# Altium schematic sheet CC1101_DoorState.SchDoc
size A0
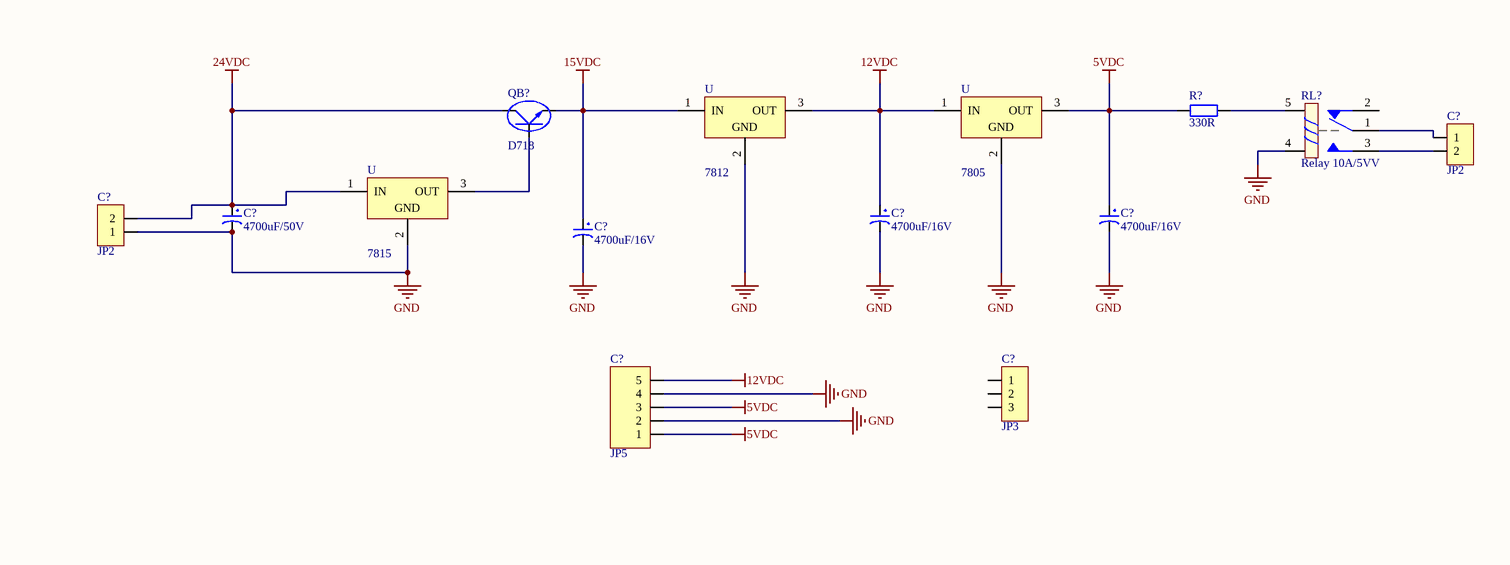
[diagram p0: CC1101_DoorState.SchDoc, top right]
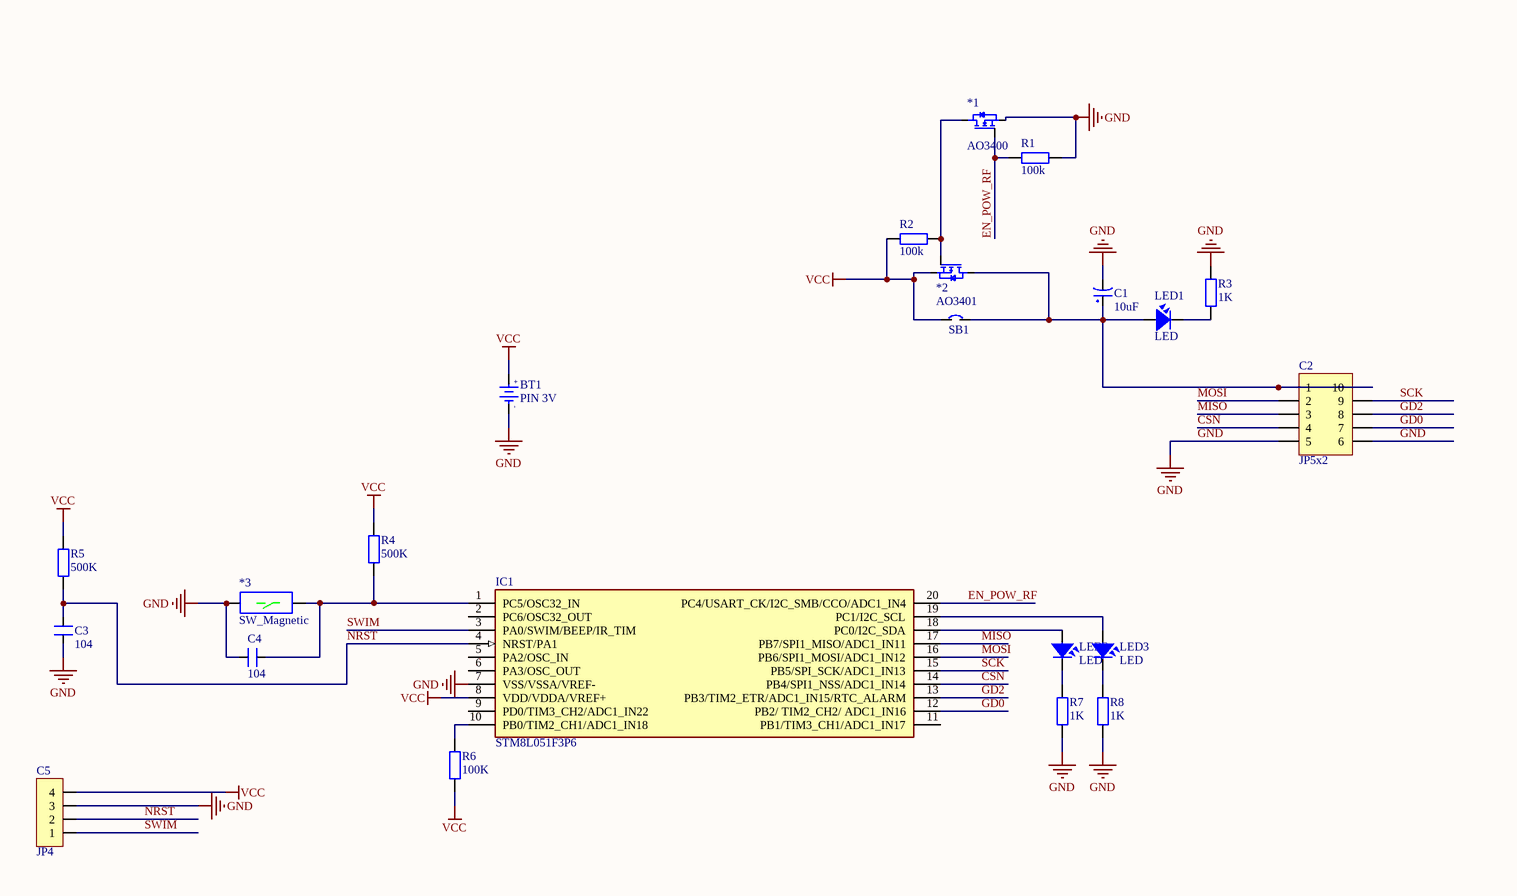
[diagram p1: CC1101_DoorState.SchDoc, bottom left]

## Parts
(Parts that share a designator on the sheet are numbered #1, #2 ... from top to bottom, then left to right.)
*1  AO3400  [SOT23-123]
*2  AO3401  [SOT23-123]
*3  SW_Magnetic  [SW_Magnetic]
BT1  PIN 3V  [PIN3V]
C1  10uF  [CP1/2]
C2  JP5x2  [JP5-D2T]
C3  104  [SM-0805]
C4  104  [SM-0805]
C5  JP4  [JP4-C1T]
C?#1  JP2  [JP2-C1T]
C?#2  4700uF/50V  [CP3/7]
C?#3  4700uF/16V  [CP3/7]
C?#4  4700uF/16V  [CP3/7]
C?#5  JP2  [JP2-C1T]
C?#6  4700uF/16V  [CP3/7]
C?#7  JP3  [JP3-C1T]
C?#8  JP5  [JP5-C1T]
IC1  STM8L051F3P6  [SOP65P640X120-20N]
LED1  LED  [SM-LED-0805-Blue]
LED2  LED  [SM-LED-0805-Blue]
LED3  LED  [SM-LED-0805-Blue]
QB?  D718  [TO247+LageHeatsink]
R1  100k  [RES-SMD-0603]
R2  100k  [RES-SMD-0603]
R3  1K  [RES-SMD-0805]
R4  500K  [RES-SMD-0805]
R5  500K  [RES-SMD-0805]
R6  100K  [RES-SMD-0805]
R7  1K  [RES-SMD-0805]
R8  1K  [RES-SMD-0805]
R?  330R  [RES-1W]
RL?  Relay 10A/5VV  [RL_SPDT_10A]
SB1  SB  [SB]  (value not drawn)
U#1  7812  [TO220-123]
U#2  7805  [TO220-123]
U#3  7815  [TO220-123]

## Nets
5VDC: C?#4.1 C?#8.1 C?#8.3 R?.1 U#2.3(OUT)
12VDC: C?#3.1 C?#8.5 U#1.3(OUT) U#2.1(IN)
15VDC: C?#6.1 QB?.3(E) U#1.1(IN)
24VDC: C?#2.1 C?#5.2 QB?.2(C) U#3.1(IN)
GND: *1.3 *3.2 BT1.2(GND) C1.2 C2.5 C2.6 C3.1 C4.1 C5.3 C?#2.2 C?#3.2 C?#4.2 C?#5.1 C?#6.2 C?#8.2 C?#8.4 IC1.7(VSS/VSSA/VREF-) R1.1 R3.2 R7.1 R8.1 RL?.4 U#1.2(GND) U#2.2(GND) U#3.2(GND)
VCC: *2.3 BT1.1(+3V) C5.4 IC1.8(VDD/VDDA/VREF+) R2.2 R4.2 R5.2 R6.1 SB1.1
CSN: C2.4 IC1.14(PB4/SPI1_NSS/ADC1_IN14)
EN_POW_RF: *1.1 IC1.20(PC4/USART_CK/I2C_SMB/CCO/ADC1_IN4) R1.2
GD0: C2.7 IC1.12(PB2/_TIM2_CH2/_ADC1_IN16)
GD2: C2.8 IC1.13(PB3/TIM2_ETR/ADC1_IN15/RTC_ALARM)
MISO: C2.3 IC1.17(PB7/SPI1_MISO/ADC1_IN11)
MOSI: C2.2 IC1.16(PB6/SPI1_MOSI/ADC1_IN12)
NRST: C3.2 C5.2 IC1.4(NRST/PA1) R5.1
SCK: C2.9 IC1.15(PB5/SPI_SCK/ADC1_IN13)
SWIM: C5.1 IC1.3(PA0/SWIM/BEEP/IR_TIM)
Net*1_2: *1.2 *2.1 R2.1
Net*2_2: *2.2 C1.1 C2.1 C2.10 LED1.1 SB1.2
Net*3_1: *3.1 C4.2 IC1.1(PC5/OSC32_IN) R4.1
NetC?#1_1: C?#1.1 RL?.1
NetC?#1_2: C?#1.2 RL?.3
NetIC1_10: IC1.10(PB0/TIM2_CH1/ADC1_IN18) R6.2
NetIC1_18: IC1.18(PC0/I2C_SDA) LED2.1
NetIC1_19: IC1.19(PC1/I2C_SCL) LED3.1
NetLED1_2: LED1.2 R3.1
NetLED2_2: LED2.2 R7.2
NetLED3_2: LED3.2 R8.2
NetQB?_1: QB?.1(B) U#3.3(OUT)
NetR?_2: R?.2 RL?.5

Not connected (* = marked no-connect by the designer): C?#7 1 2 3; IC1 2(PC6/OSC32_OUT) 5(PA2/OSC_IN) 6(PA3/OSC_OUT) 9(PD0/TIM3_CH2/ADC1_IN22) 11(PB1/TIM3_CH1/ADC1_IN17); RL? 2

## Notes on the sheet
- (in symbol PIN 3V) +; -

## Library data of the parts
BT1 = PIN 3V: Battery 3VDC; Value: PIN 3V
C1 = CP1: Cap P  0,1uF < 22uF , 16 - 50V; Value: 10uF/50V; Description 1: 10 => 220uF/6,3V/10V - 10uF => 100uF/16V; Description 2: 0,1uF => 33uF/50V - 10uF => 22uF/63V; Description 3: 0,47uF => 10uF/100V
C2 = JP5x2: WR-PHD 2.54 mm Dual Socket Header; Manufacturer: W¨¹rth Elektronik eiSos GmbH; partNo: 61301021821; ComponentLink1 Description: Manufacturer; ComponentLink2 Description: Datasheet; NoPins: 10; Created Date: 29 March 2013; ComponentLink1URL: http://www.we-online.com; ComponentLink2URL: http://katalog.we-online.de/em/datasheet/6130xx21821.pdf; Created by: Karrer Zheng
C3 C4 = CM: Cap SMD; Value: 103
C5 = JP4: WR-PHD 2.54 mm Angled Socket Header; Manufacturer: W¨¹rth Elektronik eiSos GmbH; partNo: 613004143121; ComponentLink1 Description: Manufacturer; ComponentLink2 Description: Datasheet; NoPins: 04; Created Date: 29 March 2013; ComponentLink1URL: http://www.we-online.com; ComponentLink2URL: http://katalog.we-online.de/em/datasheet/6130xx143121.pdf; Created by: Karrer Zheng
C?#1 C?#5 = JP2: WR-PHD 2.54 mm Angled Socket Header; Manufacturer: W¨¹rth Elektronik eiSos GmbH; partNo: 613002143121; ComponentLink1 Description: Manufacturer; ComponentLink2 Description: Datasheet; NoPins: 02; Created Date: 29 March 2013; ComponentLink1URL: http://www.we-online.com; ComponentLink2URL: http://katalog.we-online.de/em/datasheet/6130xx143121.pdf; Created by: Karrer Zheng
C?#2-C?#4 C?#6 = CP6: Cap 4700uF/16V - 2200uF/50V; Description 5: 100uF=>220uF/200V -100uF=>330uF/350V; Description 1: 10KuF=>22KuF/6,3V - 6800uF=>15KuF/10V; Description 2: 4700uF=>10KuF/16V - 3300uF => 6800uF/25V; Description 3: 2200uF=>3300uF/50V_1KuF=>2200uF/63V; Description 4: 470uF => 1KuF/100V - 220uF-470uF/160V; Value: 2200uF/16V; Description 6: 33uF=>100/350V-400V  -  22uF=>33uF/450V
C?#7 = JP3: WR-PHD 2.54 mm Angled Socket Header; Manufacturer: W¨¹rth Elektronik eiSos GmbH; partNo: 613003143121; ComponentLink1 Description: Manufacturer; ComponentLink2 Description: Datasheet; NoPins: 03; Created Date: 29 March 2013; ComponentLink1URL: http://www.we-online.com; ComponentLink2URL: http://katalog.we-online.de/em/datasheet/6130xx143121.pdf; Created by: Karrer Zheng
C?#8 = JP5: WR-PHD 2.54 mm Angled Socket Header; Manufacturer: W¨¹rth Elektronik eiSos GmbH; partNo: 613005143121; ComponentLink1 Description: Manufacturer; ComponentLink2 Description: Datasheet; NoPins: 05; Created Date: 29 March 2013; ComponentLink1URL: http://www.we-online.com; ComponentLink2URL: http://katalog.we-online.de/em/datasheet/6130xx143121.pdf; Created by: Karrer Zheng
IC1 = STM8L051F3P6: Integrated Circuit; Manufacturer_Name: STMicroelectronics; Allied_Number: 70521164; Datasheet Link: http://www.st.com/web/en/resource/technical/document/datasheet/DM00060484.pdf; Height: 1.2mm; Manufacturer_Part_Number: STM8L051F3P6; Mouser Part Number: 511-STM8L051F3P6; Mouser Price/Stock: https://www.mouser.com/Search/Refine.aspx?Keyword=511-STM8L051F3P6; RS Part Number: 7957543P; RS Price/Stock: http://uk.rs-online.com/web/p/products/7957543P; Allied Price/Stock: http://www.alliedelec.com/stmicroelectronics-stm8l051f3p6/70521164/
QB? = D718: Transistor Power Supply; Value: D718
R1-R8 R? = R: Resistor R1/4W
RL? = Relay 1: Relay SPDT,10A - 12VDC 5 Pin; Value: Relay SPDT, 10A, 12V
U#1-U#3 = LM78XX